# Altium schematic sheet MCU.SchDoc
size A3
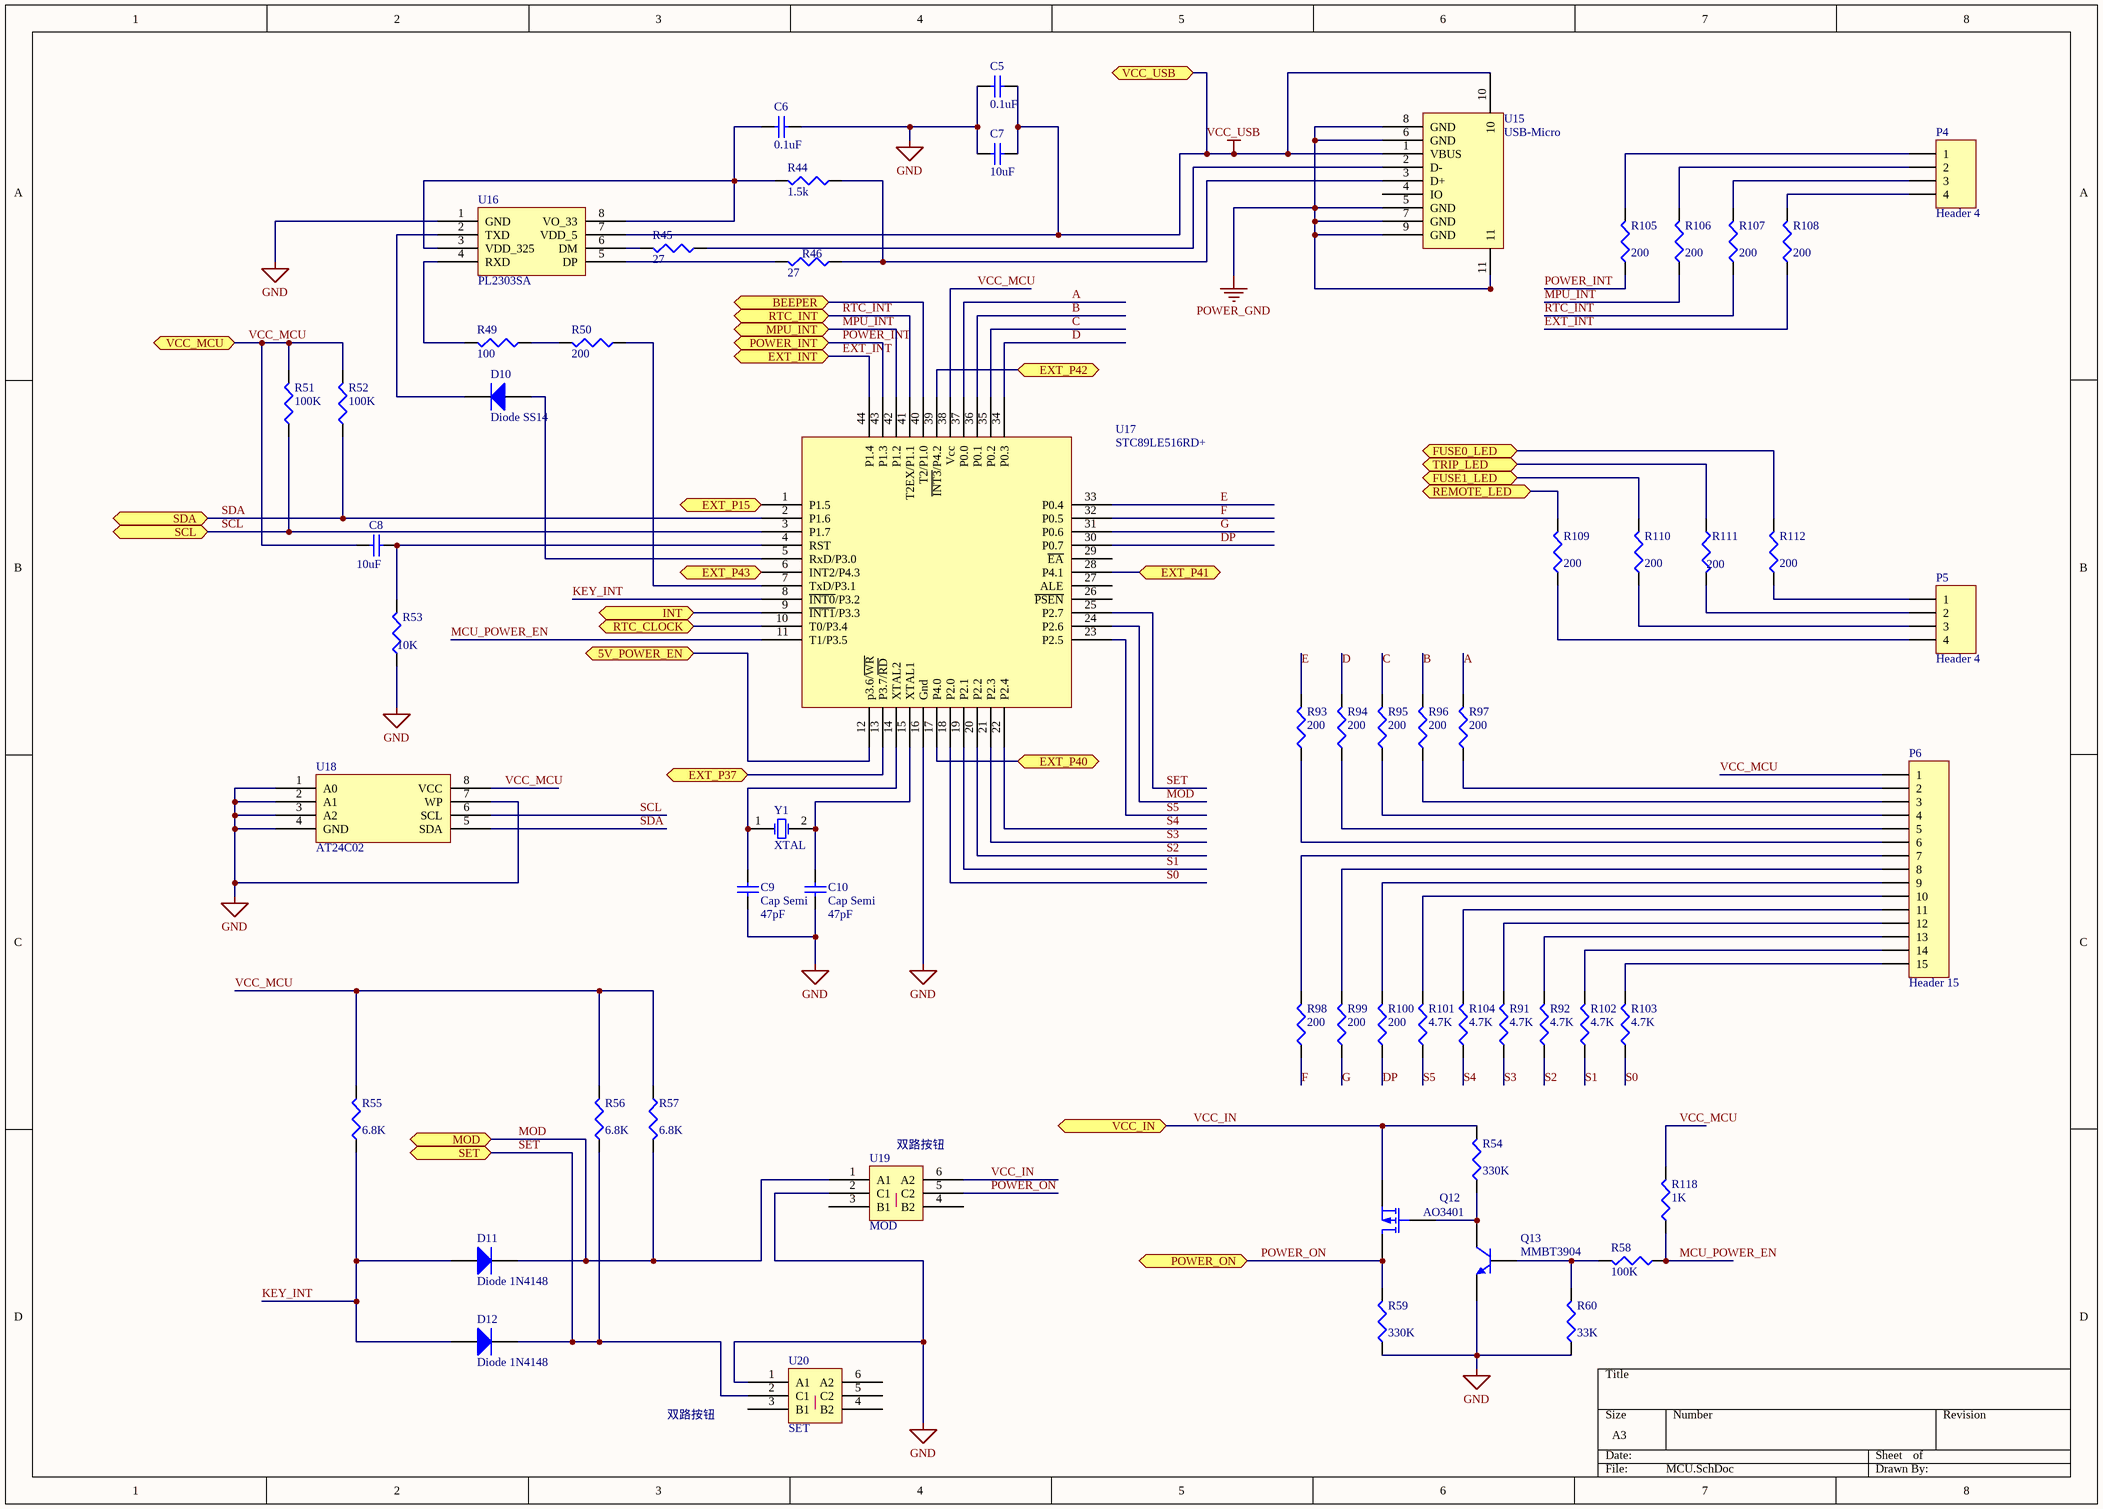
[diagram p0: MCU.SchDoc]

## Parts
C5  value 0.1uF  [0603]  (hidden comment: Cap Semi)
C6  value 0.1uF  [0603]  (hidden comment: Cap Semi)
C7  value 10uF  [0603]  (hidden comment: Cap Semi)
C8  value 10uF  [0603]  (hidden comment: Cap Semi)
C9  Cap Semi  value 47pF  [0603]
C10  Cap Semi  value 47pF  [0603]
D10  Diode SS14  [SMA]
D11  Diode 1N4148  [1206D]
D12  Diode 1N4148  [1206D]
P4  Header 4  [HDR1X4]
P5  Header 4  [HDR1X4]
P6  Header 15  [HDR1X15]
Q12  AO3401  [SOT23-3-PMOS]
Q13  MMBT3904  [SOT23-3-NPN]
R44  value 1.5k  [0603]  (hidden comment: Res3)
R45  value 27  [0603]  (hidden comment: Res3)
R46  value 27  [0603]  (hidden comment: Res3)
R49  value 100  [0603]  (hidden comment: Res3)
R50  value 200  [0603]  (hidden comment: Res3)
R51  value 100K  [0603]  (hidden comment: Res3)
R52  value 100K  [0603]  (hidden comment: Res3)
R53  value 10K  [0603]  (hidden comment: Res3)
R54  value 330K  [0603]  (hidden comment: Res3)
R55  value 6.8K  [0603]  (hidden comment: Res3)
R56  value 6.8K  [0603]  (hidden comment: Res3)
R57  value 6.8K  [0603]  (hidden comment: Res3)
R58  value 100K  [0603]  (hidden comment: Res3)
R59  value 330K  [0603]  (hidden comment: Res3)
R60  value 33K  [0603]  (hidden comment: Res3)
R91  value 4.7K  [0603]  (hidden comment: Res3)
R92  value 4.7K  [0603]  (hidden comment: Res3)
R93  value 200  [0603]  (hidden comment: Res3)
R94  value 200  [0603]  (hidden comment: Res3)
R95  value 200  [0603]  (hidden comment: Res3)
R96  value 200  [0603]  (hidden comment: Res3)
R97  value 200  [0603]  (hidden comment: Res3)
R98  value 200  [0603]  (hidden comment: Res3)
R99  value 200  [0603]  (hidden comment: Res3)
R100  value 200  [0603]  (hidden comment: Res3)
R101  value 4.7K  [0603]  (hidden comment: Res3)
R102  value 4.7K  [0603]  (hidden comment: Res3)
R103  value 4.7K  [0603]  (hidden comment: Res3)
R104  value 4.7K  [0603]  (hidden comment: Res3)
R105  value 200  [0603]  (hidden comment: Res3)
R106  value 200  [0603]  (hidden comment: Res3)
R107  value 200  [0603]  (hidden comment: Res3)
R108  value 200  [0603]  (hidden comment: Res3)
R109  value 200  [0603]  (hidden comment: Res3)
R110  value 200  [0603]  (hidden comment: Res3)
R111  value 200  [0603]  (hidden comment: Res3)
R112  value 200  [0603]  (hidden comment: Res3)
R118  value 1K  [0603]  (hidden comment: Res3)
U15  USB-Micro  [USB-Micro]
U16  PL2303SA  [SOP8]
U17  STC89LE516RD+  [LQFP44]
U18  AT24C02  [SOP8]
U19  MOD  [HDR2X3]
U20  SET  [HDR2X3]
Y1  XTAL  [XTAL]

## Ports
5V_POWER_EN (bidir), BEEPER (bidir), EXT_INT (bidir), EXT_P15 (bidir), EXT_P37 (bidir), EXT_P40 (bidir), EXT_P41 (bidir), EXT_P42 (bidir), EXT_P43 (bidir), FUSE0_LED (bidir), FUSE1_LED (bidir), INT (bidir), MOD (bidir), MPU_INT (bidir), POWER_INT (bidir), POWER_ON (bidir), REMOTE_LED (bidir), RTC_CLOCK (bidir), RTC_INT (bidir), SCL (bidir), SDA (bidir), SET (bidir), TRIP_LED (bidir), VCC_IN (bidir), VCC_MCU (bidir), VCC_USB (bidir)

## Nets
GND: C5.1 C6.2 C7.1 C9.1 C10.1 Q13.1(E) R53.1 R59.1 R60.1 U16.1(GND) U17.16(Gnd) U18.1(A0) U18.2(A1) U18.3(A2) U18.4(GND) U18.7(WP) U19.2(C1) U20.1(A1)
POWER_GND: U15.5(GND) U15.6(GND) U15.7(GND) U15.8(GND) U15.9(GND) U15.11
VCC_USB: C5.2 C7.2 U15.1(VBUS) U15.10 U16.7(VDD_5) ; port VCC_USB
5V_POWER_EN: U17.12(p3.6/~{WR}) ; port 5V_POWER_EN
A: R97.2 U17.37(P0.0)
B: R96.2 U17.36(P0.1)
BEEPER: U17.40(T2/P1.0) ; port BEEPER
C: R95.2 U17.35(P0.2)
D: R94.2 U17.34(P0.3)
DP: R100.1 U17.30(P0.7)
E: R93.2 U17.33(P0.4)
EXT_INT: R108.1 U17.44(P1.4) ; port EXT_INT
EXT_P15: U17.1(P1.5) ; port EXT_P15
EXT_P37: U17.13(P3.7/~{RD}) ; port EXT_P37
EXT_P40: U17.17(P4.0) ; port EXT_P40
EXT_P41: U17.28(P4.1) ; port EXT_P41
EXT_P42: U17.39(~{INT3}/P4.2) ; port EXT_P42
EXT_P43: U17.6(INT2/P4.3) ; port EXT_P43
F: R98.1 U17.32(P0.5)
FUSE0_LED: R112.2 ; port FUSE0_LED
FUSE1_LED: R110.2 ; port FUSE1_LED
G: R99.1 U17.31(P0.6)
INT: U17.9(~{INT1}/P3.3) ; port INT
KEY_INT: D11.1(A) D12.1(A) R55.1 U17.8(~{INT0}/P3.2)
MCU_POWER_EN: R58.1 R118.1 U17.11(T1/P3.5)
MOD: D11.2(K) R57.2 U17.24(P2.6) U19.1(A1) ; port MOD
MPU_INT: R106.1 U17.42(P1.2) ; port MPU_INT
POWER_INT: R105.1 U17.43(P1.3) ; port POWER_INT
POWER_ON: Q12.1(D) R59.2 U19.5(C2) ; port POWER_ON
REMOTE_LED: R109.2 ; port REMOTE_LED
RTC_CLOCK: U17.10(T0/P3.4) ; port RTC_CLOCK
RTC_INT: R107.1 U17.41(T2EX/P1.1) ; port RTC_INT
S0: R103.1 U17.18(P2.0)
S1: R102.1 U17.19(P2.1)
S2: R92.1 U17.20(P2.2)
S3: R91.1 U17.21(P2.3)
S4: R104.1 U17.22(P2.4)
S5: R101.1 U17.23(P2.5)
SCL: R51.1 U17.3(P1.7) U18.6(SCL) ; port SCL
SDA: R52.1 U17.2(P1.6) U18.5(SDA) ; port SDA
SET: D12.2(K) R56.1 U17.25(P2.7) U20.2(C1) ; port SET
TRIP_LED: R111.1 ; port TRIP_LED
VCC_IN: Q12.3(S) R54.2 U19.6(A2) ; port VCC_IN
VCC_MCU: C8.2 P6.1 R51.2 R52.2 R55.2 R56.2 R57.1 R118.2 U17.38(Vcc) U18.8(VCC) ; port VCC_MCU
NetC6_1: C6.1 R44.2 U16.3(VDD_325) U16.8(VO_33)
NetC8_1: C8.1 R53.2 U17.4(RST)
NetC9_2: C9.2 U17.14(XTAL2) Y1.1(OSC1)
NetC10_2: C10.2 U17.15(XTAL1) Y1.2(OSC2)
NetD10_1: D10.1(A) U17.5(RxD/P3.0)
NetD10_2: D10.2(K) U16.2(TXD)
NetP4_1: P4.1 R105.2
NetP4_2: P4.2 R106.2
NetP4_3: P4.3 R107.2
NetP4_4: P4.4 R108.2
NetP5_1: P5.1 R112.1
NetP5_2: P5.2 R111.2
NetP5_3: P5.3 R110.1
NetP5_4: P5.4 R109.1
NetP6_2: P6.2 R97.1
NetP6_3: P6.3 R96.1
NetP6_4: P6.4 R95.1
NetP6_5: P6.5 R94.1
NetP6_6: P6.6 R93.1
NetP6_7: P6.7 R98.2
NetP6_8: P6.8 R99.2
NetP6_9: P6.9 R100.2
NetP6_10: P6.10 R101.2
NetP6_11: P6.11 R104.2
NetP6_12: P6.12 R91.2
NetP6_13: P6.13 R92.2
NetP6_14: P6.14 R102.2
NetP6_15: P6.15 R103.2
NetQ12_2: Q12.2(G) Q13.3(C) R54.1
NetQ13_2: Q13.2(B) R58.2 R60.2
NetR44_1: R44.1 R46.1 U15.3(D+)
NetR45_1: R45.1 U15.2(D-)
NetR45_2: R45.2 U16.6(DM)
NetR46_2: R46.2 U16.5(DP)
NetR49_1: R49.1 R50.2
NetR49_2: R49.2 U16.4(RXD)
NetR50_1: R50.1 U17.7(TxD/P3.1)

Not connected (* = marked no-connect by the designer): U15 4(IO); U17 26(~{PSEN}) 27(ALE) 29(~{EA}); U19 3(B1) 4(B2); U20 3(B1) 4(B2) 5(C2) 6(A2)

## Notes on the sheet
- (near U19) 双路按钮
- 双路按钮

## Library data of the parts
C5-C10 = Cap Semi: Capacitor (Semiconductor SIM Model); Published: 8-Jun-2000; LatestRevisionDate: 29-May-2009; LatestRevisionNote: IPC-7351 Footprint Added.; PackageReference: C1206; Publisher: Altium Limited; PackageDescription: Chip Capacitor
D10-D12 = Diode 1N4005: 1 Amp General Purpose Rectifier; Published: 8-Jun-2000; LatestRevisionDate: 17-Jul-2002; LatestRevisionNote: Re-released for DXP Platform.; DatasheetVersion: 1998; PackageVersion: Aug-1999; PackageReference: DO-41; Publisher: Altium Limited; PackageDescription: Diode, Axial; Body 5.2 x 2.7 mm (LxDia. max), Lead Dia. 0.86 mm (max); Code_JEDEC: DO-204-AL; ComponentLink1Description: Manufacturer Link; ComponentLink1URL: http://www.fairchildsemi.com/; ComponentLink2Description: Datasheet; ComponentLink2URL: http://www.fairchildsemi.com/ds/1N%2F1N4001.pdf
P4 P5 = Header 4: Header, 4-Pin; LatestRevisionDate: 17-Jul-2002; LatestRevisionNote: Re-released for DXP Platform.; Publisher: Altium Limited
P6 = Header 15: Header, 15-Pin; LatestRevisionDate: 17-Jul-2002; LatestRevisionNote: Re-released for DXP Platform.; Publisher: Altium Limited
Q12 = MOSFET-P: P-Channel MOSFET; Published: 8-Jun-2000; LatestRevisionDate: 17-Jul-2002; LatestRevisionNote: Re-released for DXP Platform.; PackageVersion: 1995/1996; PackageReference: E3; Publisher: Altium Limited; PackageDescription: TO, Flat Index; 3 In-Line, Axial Leads; Body Dia. 4.6mm; Lead Dia. 0.5 mm (max)
Q13 = 2N3904: NPN General Purpose Amplifier; Published: 8-Jun-2000; LatestRevisionDate: 15-Jan-2003; LatestRevisionNote: PCB Footprint 'BCY-W3/D4.7' replaced; DatasheetVersion: 1997; PackageVersion: Sep-1998; PackageReference: TO-92A; Publisher: Altium Limited; PackageDescription: TO, Flat Index; 3 In-Line, Axial Leads; Body Dia. 4.5mm; Leads 0.51 x 0.48 mm (max); ComponentLink1Description: Manufacturer Link; ComponentLink1URL: http://www.fairchildsemi.com/; ComponentLink2Description: Datasheet; ComponentLink2URL: http://www.fairchildsemi.com/ds/2N%2F2N3904.pdf
R44-R46 R49-R60 R91-R112 R118 = Res3: Resistor; Published: 8-Jun-2000; LatestRevisionDate: 29-May-2009; LatestRevisionNote: IPC-7351 Footprint Added.; PackageReference: J1-0603; Publisher: Altium Limited; PackageDescription: Chip Resistor
U19 U20 = BUTTON
Y1 = XTAL: Crystal Oscillator; Published: 8-Jun-2000; LatestRevisionDate: 17-Jul-2002; LatestRevisionNote: Re-released for DXP Platform.; PackageReference: R38; Publisher: Altium Limited; PackageDescription: Crystal, Thru-Hole; 2 Leads; Body 3.1 x 8.2 mm (Dia.xH)